# EAGLE design simple_clock (EAGLE 9.5.2)
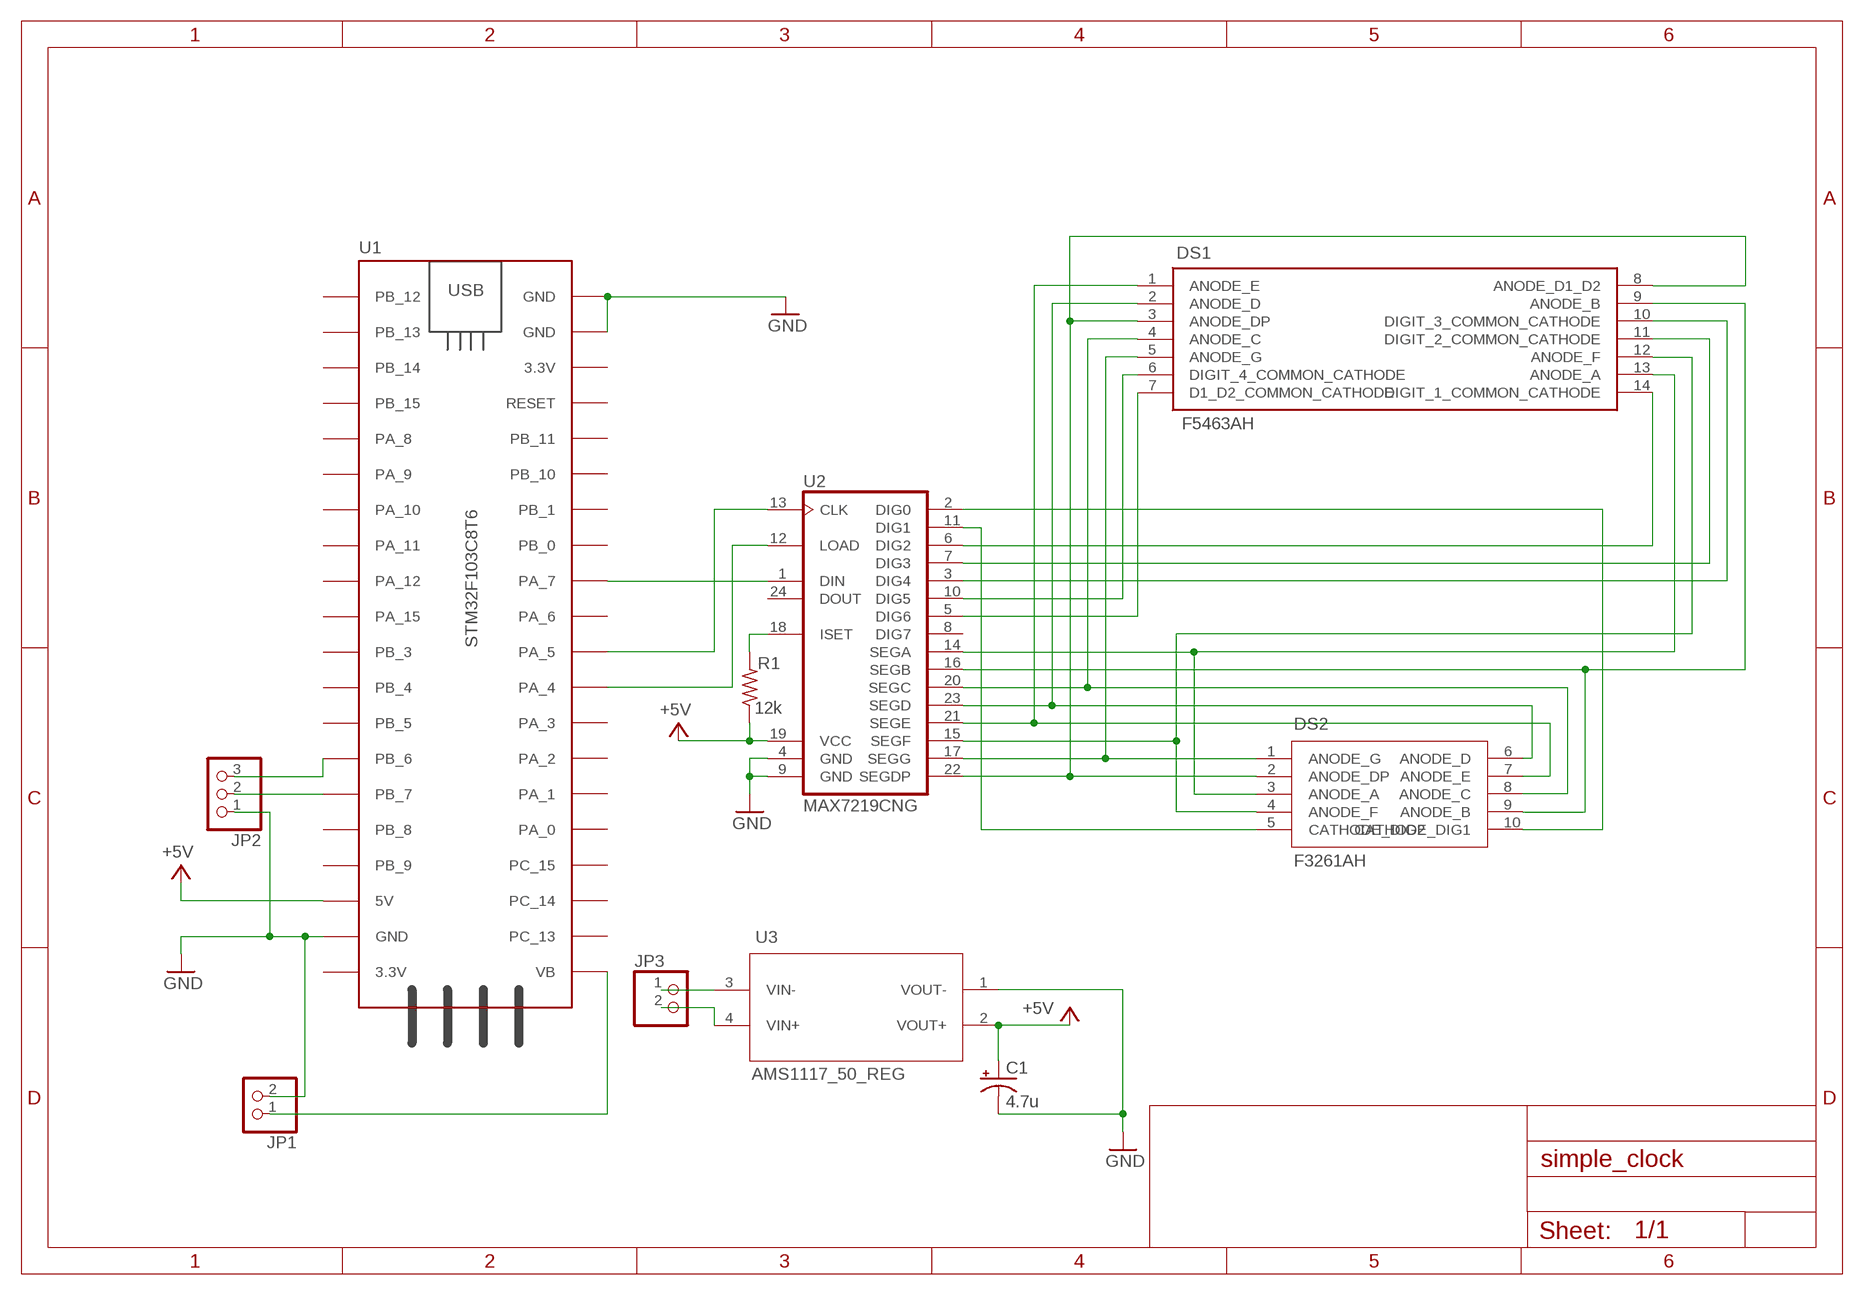
[diagram p0: schematic, sheet 1]

## Parts
C1  4.7u  CPOL-USE1.8-4  [E1,8-4]
DS1  F5463AH  [F5463AH]
DS2  F3261AH  [F3261AH]
JP1  PINHD-1X2  [1X02]
JP2  PINHD-1X3  [1X03]
JP3  PINHD-1X2  [1X02]
R1  12k  R-US_0207/12  [0207/12]
U1  STM32F103C8T6  [STM32F103C8T6]
U2  MAX7219CNG  [DIL24-3]
U3  AMS1117_50_REG  [AMS1117_50_REG]

## Nets
+5V [power]: C1.+ R1.1 U1.5V U2.19(VCC) U3.2(VOUT+)
GND [power]: C1.- JP1.2 JP2.1 U1.GND_1(GND) U1.GND_2(GND) U1.GND_3(GND) U2.4(GND) U2.9(GND) U3.1(VOUT-)
N$1: DS1.10(DIGIT_3_COMMON_CATHODE) U2.3(DIG4)
N$2: DS1.7(D1_D2_COMMON_CATHODE) U2.5(DIG6)
N$3: U1.PA_7 U2.1(DIN)
N$4: DS1.14(DIGIT_1_COMMON_CATHODE) U2.6(DIG2)
N$5: DS2.10(CATHODE_DIG1) U2.2(DIG0)
N$6: DS2.5(CATHODE_DIG2) U2.11(DIG1)
N$7: DS1.11(DIGIT_2_COMMON_CATHODE) U2.7(DIG3)
N$8: DS1.6(DIGIT_4_COMMON_CATHODE) U2.10(DIG5)
N$9: U1.PA_5 U2.13(CLK)
N$10: U1.PA_4 U2.12(LOAD)
N$11: DS1.13(ANODE_A) DS2.3(ANODE_A) U2.14(SEGA)
N$12: DS1.1(ANODE_E) DS2.7(ANODE_E) U2.21(SEGE)
N$14: DS1.12(ANODE_F) DS2.4(ANODE_F) U2.15(SEGF)
N$15: DS1.4(ANODE_C) DS2.8(ANODE_C) U2.20(SEGC)
N$16: DS1.2(ANODE_D) DS2.6(ANODE_D) U2.23(SEGD)
N$17: DS1.3(ANODE_DP) DS1.8(ANODE_D1_D2) DS2.2(ANODE_DP) U2.22(SEGDP)
N$18: DS1.5(ANODE_G) DS2.1(ANODE_G) U2.17(SEGG)
N$19: R1.2 U2.18(ISET)
N$20: JP1.1 U1.VB
N$21: JP2.2 U1.PB_7
N$22: JP2.3 U1.PB_6
N$23 [power]: JP3.1 U3.3(VIN-)
N$24 [power]: JP3.2 U3.4(VIN+)
N$25: DS1.9(ANODE_B) DS2.9(ANODE_B) U2.16(SEGB)
Unconnected: U1.3.3V_1(3.3V) U1.3.3V_2(3.3V) U1.PA_0 U1.PA_1 U1.PA_2 U1.PA_3 U1.PA_6 U1.PA_8 U1.PA_9 U1.PA_10 U1.PA_11 U1.PA_12 U1.PA_15 U1.PB_0 U1.PB_1 U1.PB_3 U1.PB_4 U1.PB_5 U1.PB_8 U1.PB_9 U1.PB_10 U1.PB_11 U1.PB_12 U1.PB_13 U1.PB_14 U1.PB_15 U1.PC_13 U1.PC_14 U1.PC_15 U1.RESET U2.8(DIG7) U2.24(DOUT)

## Library data of the parts
C1 = rcl:CPOL-US: POLARIZED CAPACITOR, American symbol; SPICEPREFIX: C
DS1 = simple_clock:F5463AH: LED Displays & Accessories 88:88 Clock Module 0.56in 4 Digits Common Cathode; DESCRIPTION: LED Displays & Accessories 88:88 Clock Module 0.56in 4 Digits CC
DS2 = simple_clock:F3261AH
JP1 JP3 = pinhead:PINHD-1X2: PIN HEADER
JP2 = pinhead:PINHD-1X3: PIN HEADER
R1 = rcl:R-US_: RESISTOR, American symbol; SPICEPREFIX: R
U1 = stm32f103c8t6_module:STM32F103C8T6: STM32F103C8T6 module with ARM Cortex-3, 20kB SRAM, 64kB Flash, 72MHz
U2 = maxim:MAX7219CNG: LED DISPLAY DRIVER; MF: MAXIM; MPN: MAX7219CNG; OC_FARNELL: 1523914; OC_NEWARK: 34C4018
U3 = simple_clock:AMS1117_50_REG

## Net classes
0 default: width 0.406 mm, drill 0.61 mm, clearance 0.305 mm
1 power: width 0.61 mm, drill 0.61 mm, clearance 0.305 mm

## Board
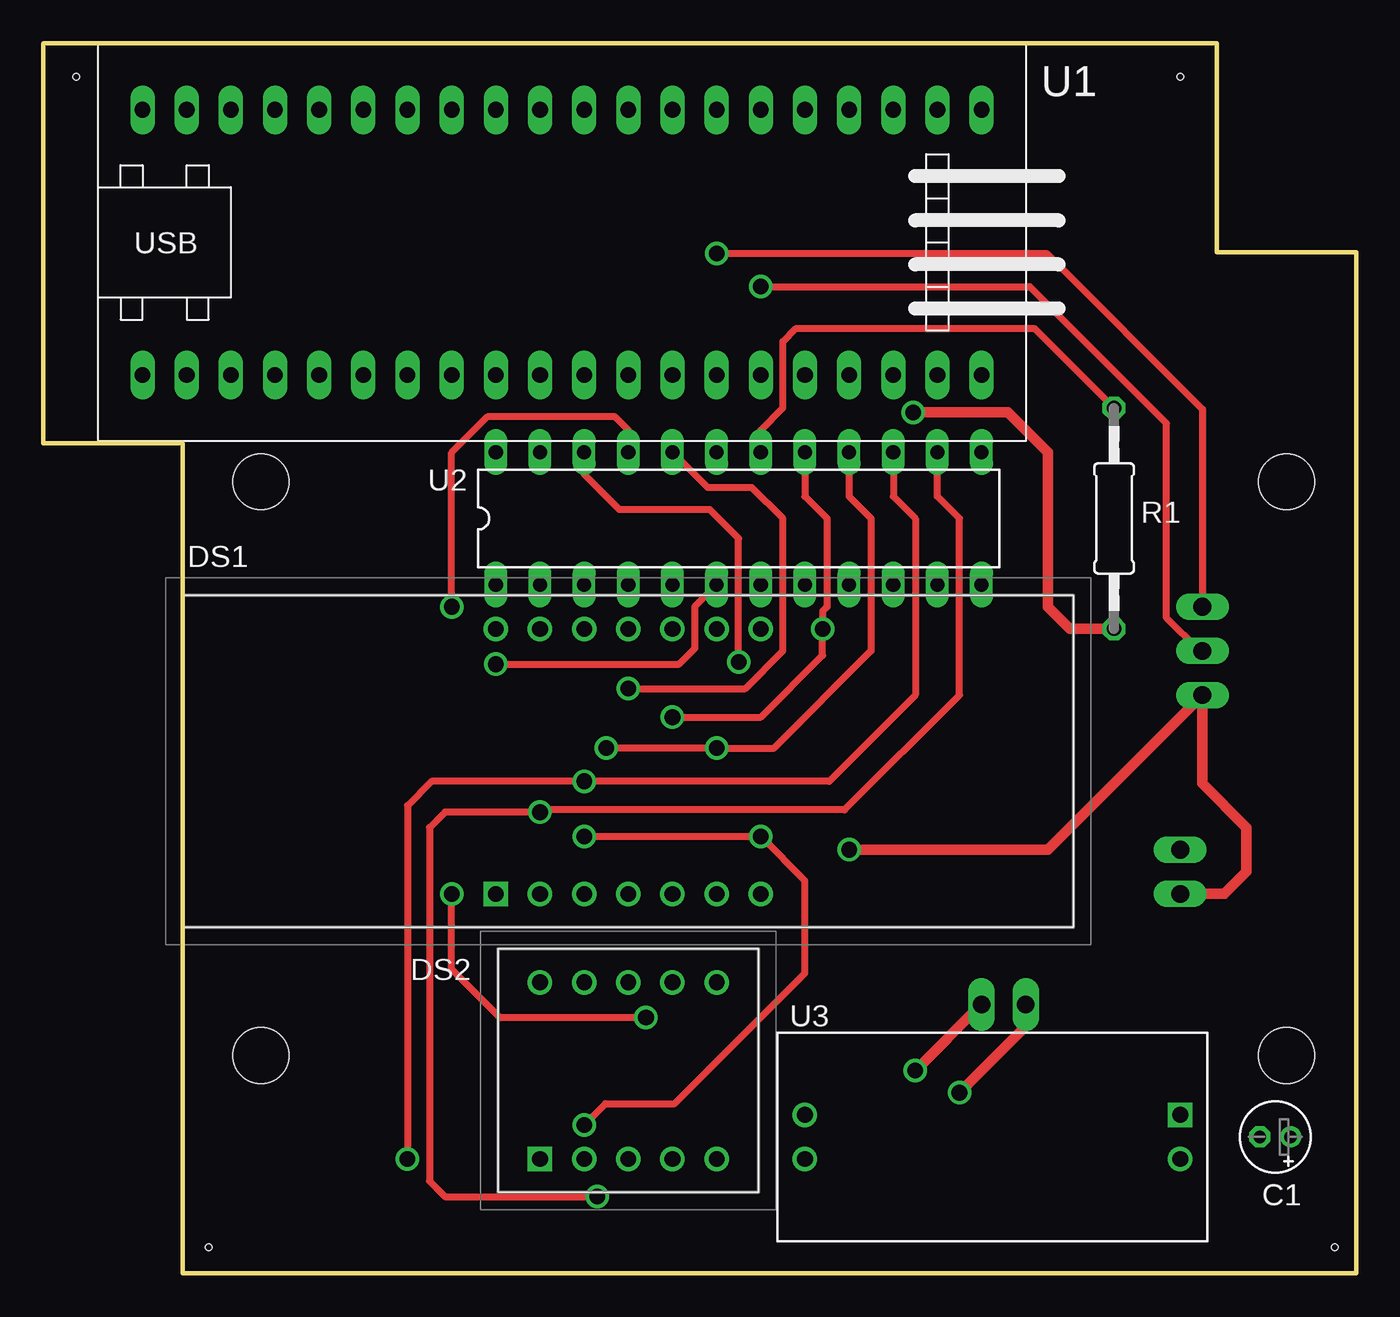
[diagram p1: board, top side]
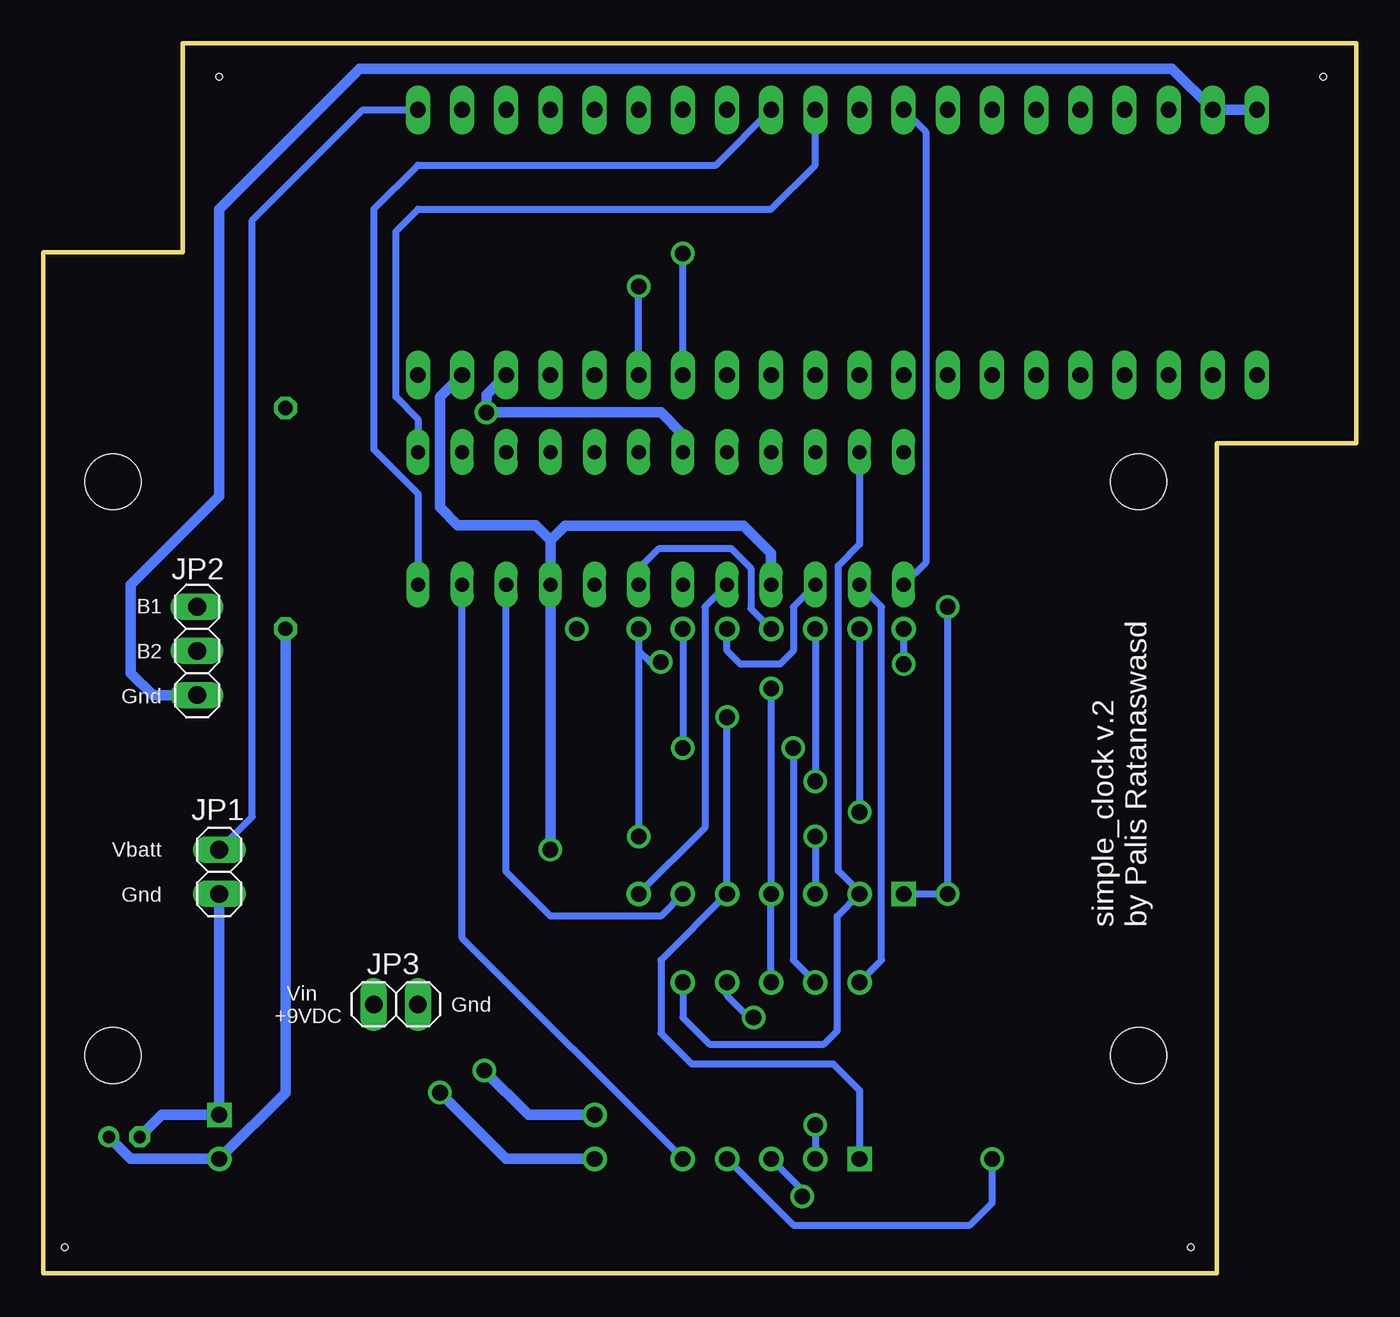
[diagram p2: board, bottom side, seen from below]

Size 75.5 x 70.7 mm. Coordinates in mm from the lower left corner, seen from the top.
Outline: 67.5,58.7 67.5,70.7 0,70.7 0,47.7 8,47.7 8,0 75.5,0 75.5,58.7 67.5,58.7
Copper layers (1*16): Top 0.035mm / dielectric 1.5mm / Bottom 0.035mm
Design rules "default": minimum track width 6mil, minimum drill 0.35mm, track to track 6mil, track to pad 6mil, pad to pad 6mil, via to via 6mil, smd to smd 6mil, copper to edge 40mil, drill to drill 6mil, minimum pad ring 10mil, minimum via ring 8mil, stop-mask expansion 4mil, vias tented up to drill 0mil, thermal gap 10mil
Holes 3.2 mm at 12.5,45.5 12.5,12.5 71.5,45.5 71.5,12.5
Holes 0.35 mm at 65.39,68.79 9.51,1.48 74.28,1.48 1.89,68.79

### Footprints (pad centres in the part's own frame; a part is rotated, then mirrored left to right if it is on the bottom)
E1,8-4 = drill 0.711 pad 1.168: + -0.889,0 | drill 0.711 pad 1.168 octagon: - 0.889,0
F5463AH = drill 0.9 square: 1 -7.62,-7.62 | drill 0.9: 2 -5.08,-7.62; 3 -2.54,-7.62; 4 0,-7.62; 5 2.54,-7.62; 6 5.08,-7.62; 7 7.62,-7.62; 8 7.62,7.62; 9 5.08,7.62; 10 2.54,7.62; 11 0,7.62; 12 -2.54,7.62; 13 -5.08,7.62; 14 -7.62,7.62
F3261AH = drill 0.9 square: 1 -5.08,-5.08 | drill 0.9: 2 -2.54,-5.08; 3 0,-5.08; 4 2.54,-5.08; 5 5.08,-5.08; 6 5.08,5.08; 7 2.54,5.08; 8 0,5.08; 9 -2.54,5.08; 10 -5.08,5.08
1X02 = drill 1.016 long: 1 -1.27,0; 2 1.27,0
1X03 = drill 1.016 long: 1 -2.54,0; 2 0,0; 3 2.54,0
0207/12 = drill 0.813 octagon: 1 -6.35,0; 2 6.35,0
STM32F103C8T6 = drill 0.9 long: 3.3V_1 25.4,-7.62; 3.3V_2 -17.78,7.62; 5V 20.32,-7.62; GND_1 22.86,-7.62; GND_2 -20.32,7.62; GND_3 -22.86,7.62; PA_0 15.24,7.62; PA_1 12.7,7.62; PA_2 10.16,7.62; PA_3 7.62,7.62; PA_4 5.08,7.62; PA_5 2.54,7.62; PA_6 0,7.62; PA_7 -2.54,7.62; PA_8 -12.7,-7.62; PA_9 -10.16,-7.62; PA_10 -7.62,-7.62; PA_11 -5.08,-7.62; PA_12 -2.54,-7.62; PA_15 0,-7.62; PB_0 -5.08,7.62; PB_1 -7.62,7.62; PB_3 2.54,-7.62; PB_4 5.08,-7.62; PB_5 7.62,-7.62; PB_6 10.16,-7.62; PB_7 12.7,-7.62; PB_8 15.24,-7.62; PB_9 17.78,-7.62; PB_10 -10.16,7.62; PB_11 -12.7,7.62; PB_12 -22.86,-7.62; PB_13 -20.32,-7.62; PB_14 -17.78,-7.62; PB_15 -15.24,-7.62; PC_13 22.86,7.62; PC_14 20.32,7.62; PC_15 17.78,7.62; RESET -15.24,7.62; VB 25.4,7.62
DIL24-3 = drill 0.813 long: 1 -13.97,-3.81; 2 -11.43,-3.81; 3 -8.89,-3.81; 4 -6.35,-3.81; 5 -3.81,-3.81; 6 -1.27,-3.81; 7 1.27,-3.81; 8 3.81,-3.81; 9 6.35,-3.81; 10 8.89,-3.81; 11 11.43,-3.81; 12 13.97,-3.81; 13 13.97,3.81; 14 11.43,3.81; 15 8.89,3.81; 16 6.35,3.81; 17 3.81,3.81; 18 1.27,3.81; 19 -1.27,3.81; 20 -3.81,3.81; 21 -6.35,3.81; 22 -8.89,3.81; 23 -11.43,3.81; 24 -13.97,3.81
AMS1117_50_REG = drill 0.9 square: 1 10.16,1.27 | drill 0.9: 2 10.16,-1.27; 3 -11.43,1.27; 4 -11.43,-1.27

### Placement (x,y rotation side)
C1  70.85,7.83 180 top
DS1  33.64,29.42 0 top
DS2  33.64,11.64 0 top
JP1  65.39,23.07 270 bottom
JP2  66.66,35.77 90 bottom
JP3  55.23,15.45 180 bottom
R1  61.58,43.39 90 top
U1  28.56,59.27 0 top
U2  39.99,43.39 0 top
U3  55.23,7.83 0 top

### Tracks (layer width: path | path; a pad name or v marks a point on that pad's centre or on a via)
+5V  (via drill 0.9)
  Top 0.61: R1.1 59.04,37.04 57.77,38.31 57.77,47.2 55.48,49.49 v50.02,49.49
  Bottom 0.61: U2.19 38.72,48.22 39.99,49.49 40.12,49.49 v50.02,49.49 50.02,50.5 U1.5V | C1.+ 70.47,6.56 U3.2 61.58,10.37 R1.1
GND  (via drill 0.9)
  Top 0.61: JP1.2 67.93,21.8 69.2,23.07 69.2,25.61 66.66,28.15 JP2.1 57.77,24.34 v46.34,24.34
  Bottom 0.61: 46.34,42.14 U2.9 v46.34,24.34 | U2.4 33.64,41.39 35.23,42.98 45.5,42.98 46.34,42.14 | U1.GND_3 U1.GND_2 8.24,66.91 10.59,69.25 57.31,69.25 65.39,61.17 65.39,44.66 70.47,39.58 70.47,34.5 69.2,33.23 JP2.1 | C1.- 68.69,9.1 U3.1 JP1.2 | U1.GND_1 52.65,50.42 52.65,50.4 52.69,50.35 52.69,44.03 51.67,43.01 47.2,43.01 46.34,42.14
N$1
  Bottom 0.406: U2.3 32.37,38.31 32.37,35.77 33.13,35.01 35.42,35.01 36.18,35.77 DS1.10
N$2
  Bottom 0.406: U2.5 37.45,38.31 37.45,25.61 DS1.7
N$3
  Bottom 0.406: U1.PA_7 24.75,65.62 24.75,40.85 U2.1
N$4  (via drill 0.9)
  Top 0.406: U2.6 37.45,38.31 37.45,35.9 36.56,35.01 v26.02,35.01
  Bottom 0.406: DS1.14 v26.02,35.01
N$5
  Bottom 0.406: DS2.10 27.29,17.99 27.29,38.31 U2.2
N$6
  Bottom 0.406: U2.11 51.42,19.26 DS2.5
N$7
  Bottom 0.406: U2.7 41.26,40.49 40.09,41.66 35.95,41.66 34.81,40.52 34.81,38.21 DS1.11
N$8
  Bottom 0.406: DS1.6 39.99,20.53 46.34,20.53 48.88,23.07 U2.10
N$9
  Bottom 0.406: U2.13 53.96,49.11 55.23,50.38 55.23,59.9 53.96,61.17 33.64,61.17 31.1,63.71 U1.PA_5
N$10
  Bottom 0.406: U2.12 53.96,44.82 56.5,47.36 56.5,61.17 53.96,63.71 36.81,63.71 U1.PA_4
N$11  (via drill 0.9)
  Top 0.406: U2.14 51.42,44.66 52.69,43.39 52.69,33.23 46.09,26.63 28.69,26.63 v28.56,26.5 23.1,26.5 22.21,25.61 22.21,5.29 23.1,4.4 v31.86,4.4
  Bottom 0.406: DS1.13 v28.56,26.5 | DS2.3 31.86,4.78 v31.86,4.4
N$12  (via drill 0.9)
  Top 0.406: v23.48,38.31 23.48,47.19 25.52,49.23 32.88,49.23 33.64,48.47 U2.21 | v34.66,14.69 26.27,14.69 23.48,17.48 v23.48,21.8
  Bottom 0.406: DS1.1 v23.48,21.8 v23.48,38.31 | DS2.7 36.18,15.96 34.91,14.69 v34.66,14.69
N$14  (via drill 0.9)
  Top 0.406: v20.94,6.56 20.94,26.88 22.34,28.28 v31.1,28.28 45.2,28.28 50.15,33.23 50.15,43.39 48.88,44.66 U2.15
  Bottom 0.406: DS2.4 32.37,2.75 22.21,2.75 20.94,4.02 v20.94,6.56 | DS1.12 v31.1,28.28
N$15  (via drill 0.9)
  Top 0.406: v33.64,33.61 40.37,33.61 42.53,35.77 42.53,43.39 40.75,45.17 38.21,45.17 U2.20
  Bottom 0.406: DS2.8 DS1.4 v33.64,33.61
N$16
  Bottom 0.406: U2.23 28.56,41.89 29.77,40.68 29.77,23.13 28.56,21.92 DS1.2 29.83,20.53 29.83,13.93 30.59,13.16 37.2,13.16 38.72,14.69 DS2.6
N$17  (via drill 0.9)
  Top 0.406: U2.22 31.1,45.93 33.13,43.9 38.34,43.9 39.99,42.25 v39.99,35.14 | v31.1,25.1 v41.26,25.1 43.8,22.56 43.8,17.23 36.31,9.73 32.33,9.73 v31.1,8.51
  Bottom 0.406: v31.1,25.1 DS1.3 | v31.1,8.51 DS2.2 | DS1.8 41.26,35.77 | 41.26,35.77 v41.26,25.1 | v39.99,35.14 40.62,35.14 41.26,35.77
N$18  (via drill 0.9)
  Top 0.406: U2.17 43.8,44.66 45.07,43.39 45.07,38.31 44.82,38.06 v44.82,37.04 44.82,35.52 41.26,31.96 v36.18,31.96
  Bottom 0.406: DS2.1 28.56,10.5 30.08,12.02 38.21,12.02 39.99,13.8 39.99,17.99 DS1.5 v36.18,31.96
N$19
  Top 0.406: R1.2 57.01,54.31 43.29,54.31 42.53,53.55 42.53,49.74 41.26,48.47 U2.18
N$20
  Bottom 0.406: JP1.1 63.48,26.25 63.48,60.53 57.14,66.89 U1.VB
N$21  (via drill 0.9)
  Top 0.406: JP2.2 66.5,35.77 64.6,37.67 64.6,48.85 57.56,55.88 56.79,56.66 56.72,56.73 v41.26,56.73
  Bottom 0.406: U1.PB_7 v41.26,56.73
N$22  (via drill 0.9)
  Top 0.406: JP2.3 66.66,49.68 57.71,58.63 v38.72,58.63
  Bottom 0.406: U1.PB_6 v38.72,58.63
N$23  (via drill 0.9)
  Top 0.61: v50.15,11.64 JP3.1
  Bottom 0.61: U3.3 47.61,9.1 v50.15,11.64
N$24  (via drill 0.9)
  Top 0.61: v52.69,10.37 56.5,14.18 JP3.2
  Bottom 0.61: U3.4 48.88,6.56 v52.69,10.37
N$25  (via drill 0.9)
  Top 0.406: U2.16 46.34,44.66 47.61,43.39 47.61,35.77 42.02,30.18 v38.72,30.18 v32.37,30.18
  Bottom 0.406: DS2.9 32.37,17.99 v32.37,30.18 | DS1.9 v38.72,30.18

### Text on the board
bPlace: B1 / / B2 / / Gnd | Vbatt / / Gnd | simple_clock v.2 / by Palis Ratanaswasd | Gnd | Vin / +9VDC